# Altium project COMM_BOARD_V1.PrjPcb (part 2 of 2)
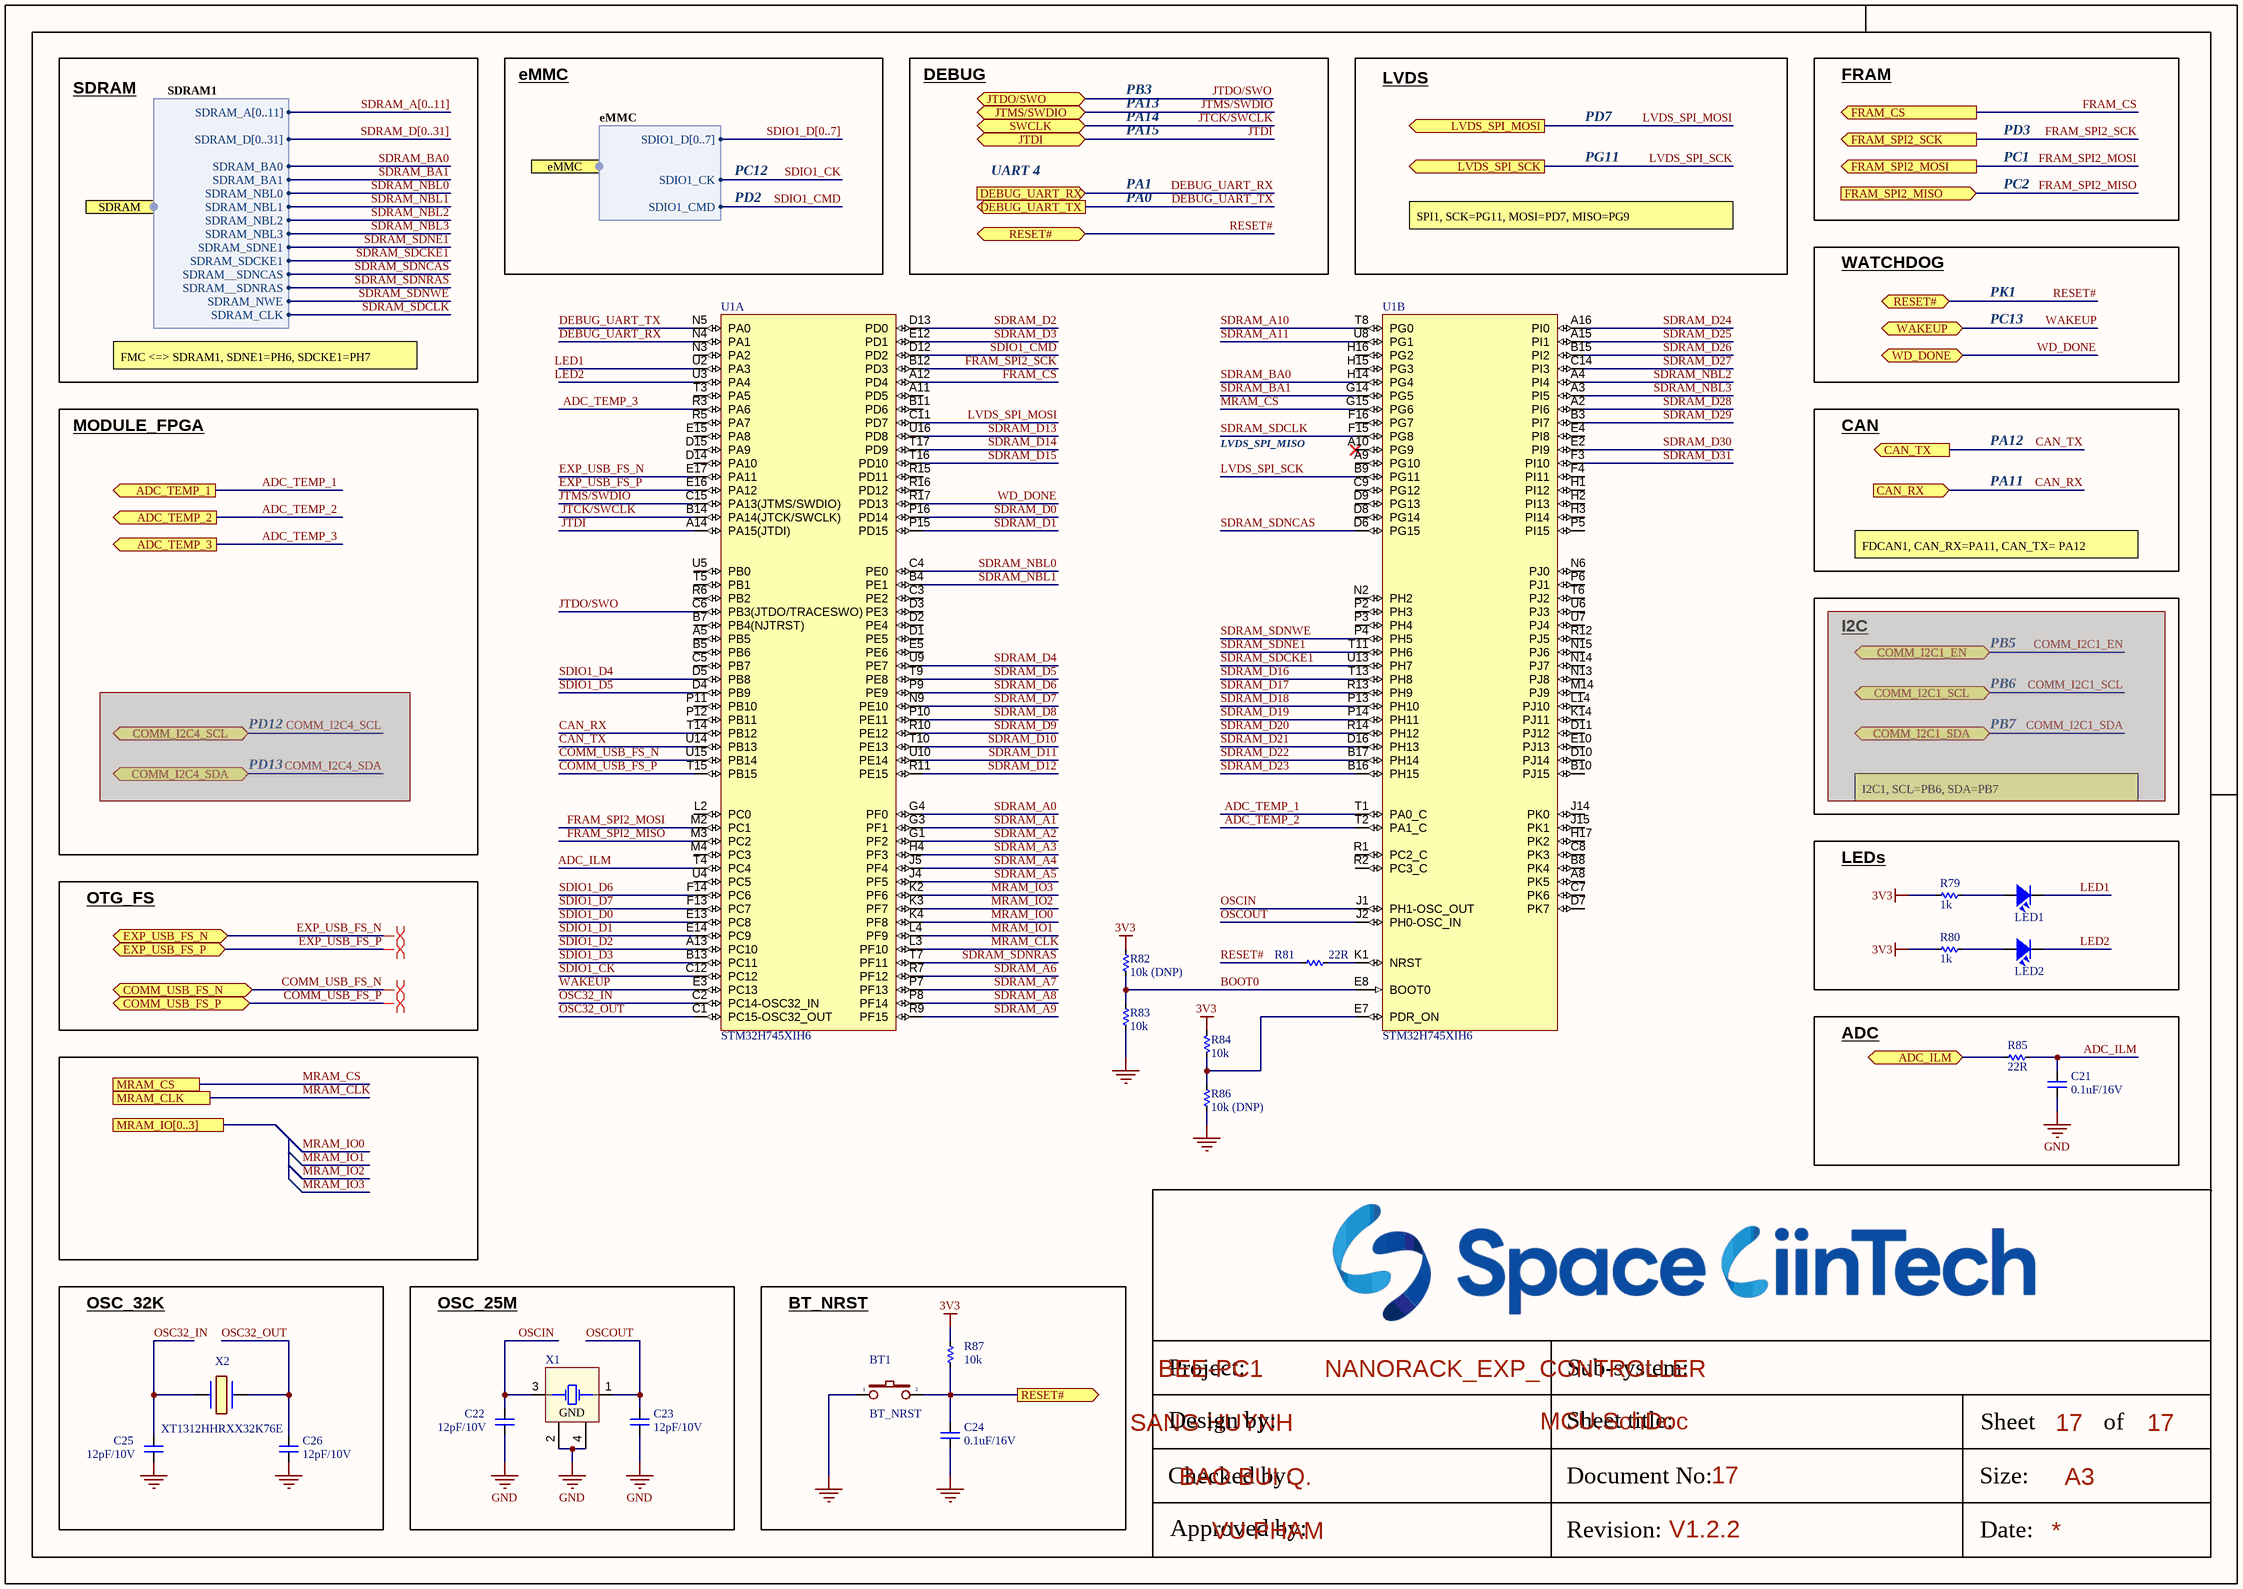
[diagram p17: MCU.SchDoc]

## Nets that join several sheets
3V3: POWER (8 pins), eMMC (38 pins), SDRAM (28 pins), MRAM (C31.2 C32.2 U4.8), LVDS (6 pins), CAN (C33.1 C34.1 U5.3), FRAM (5 pins), TEMP_CTRL (6 pins), WATCHDOG (C59.2 U15.1), DEBUG (J5.10 J5BK.1), MCU_POWER (57 pins), MCU (5 pins)
12V_CONN: CONNECTOR (J2.1 J2B.9), POWER (9 pins)
GND: CONNECTOR (20 pins), POWER (27 pins), USB_FS (8 pins), eMMC (27 pins), SDRAM (28 pins), MRAM (C31.1 C32.1 U4.4), LVDS (11 pins), CAN (6 pins), FRAM (C58.1 U14.4), TEMP_CTRL (9 pins), WATCHDOG (C59.1 R161.1 R162.1 U15.2), DEBUG (J5.6 J5BK.9), MCU_POWER (84 pins), MCU (11 pins)
ADC_TEMP_1: TEMP_CTRL (C98.2 R163.2), MCU (U1.T1)
ADC_TEMP_2: TEMP_CTRL (C100.2 R164.2), MCU (U1.T2)
ADC_TEMP_3: TEMP_CTRL (C103.2 R165.2), MCU (U1.R3)
CAN_RX: CAN (U5.4), MCU (U1.T14)
CAN_TX: CAN (U5.1), MCU (U1.U14)
COMM_USB_FS_N: USB_FS (J6.2), MCU (U1.U15)
COMM_USB_FS_P: USB_FS (J6.3), MCU (U1.T15)
DEBUG_UART_RX: DEBUG (J5.8 J5BK.5), MCU (U1.N4)
DEBUG_UART_TX: DEBUG (J5.7 J5BK.7), MCU (U1.N5)
EXP_USB_FS_N: CONNECTOR (J2.8 J2B.2), MCU (U1.E17)
EXP_USB_FS_P: CONNECTOR (J2.7 J2B.3), MCU (U1.E16)
FRAM_CS: FRAM (R154.1), MCU (U1.A12)
FRAM_SPI2_MISO: FRAM (R157.1), MCU (U1.M3)
FRAM_SPI2_MOSI: FRAM (R156.1), MCU (U1.M2)
FRAM_SPI2_SCK: FRAM (R155.1), MCU (U1.B12)
JTCK/SWCLK: DEBUG (J5.4 J5BK.4), MCU (U1.B14)
JTDI: DEBUG (J5.2 J5BK.8), MCU (U1.A14)
JTDO/SWO: DEBUG (J5.5 J5BK.2), MCU (U1.C6)
JTMS/SWDIO: DEBUG (J5.3 J5BK.6), MCU (U1.C15)
LVDS_SPI_MOSI: LVDS (U6.5), MCU (U1.C11)
LVDS_SPI_SCK: LVDS (U7.5), MCU (U1.B9)
MRAM_CLK: MRAM (R98.2), MCU (U1.L3)
MRAM_CS: MRAM (R94.1), MCU (U1.G15)
NetJ2_3: CONNECTOR (J2.3 J2B.7 R143.1), CAN (R114.2 TVS2.1 U5.7)
NetJ2_4: CONNECTOR (J2.4 J2B.6 R142.1), CAN (R115.1 TVS2.2 U5.6)
NetJ2_9: CONNECTOR (J2.9 J2B.1), POWER (R88.1)
NetR85_1: POWER (R126.1 U9.9), MCU (R85.1)
RESET#: eMMC (R19.2), WATCHDOG (R158.2), DEBUG (J5.9 J5BK.3), MCU (BT1.2 C24.2 R81.1 R87.2)
SDIO1_CK: eMMC (R18.1 R20.1), MCU (U1.C12)
SDIO1_CMD: eMMC (R21.1 R22.1), MCU (U1.D12)
SDIO1_D0: eMMC (R1.1 R9.1), MCU (U1.E13)
SDIO1_D1: eMMC (R2.1 R10.1), MCU (U1.E14)
SDIO1_D2: eMMC (R3.1 R11.1), MCU (U1.A13)
SDIO1_D3: eMMC (R4.1 R12.1), MCU (U1.B13)
SDIO1_D4: eMMC (R5.1 R13.1), MCU (U1.D5)
SDIO1_D5: eMMC (R6.1 R14.1), MCU (U1.D4)
SDIO1_D6: eMMC (R7.1 R15.1), MCU (U1.F14)
SDIO1_D7: eMMC (R8.1 R16.1), MCU (U1.F13)
SDRAM_A0: SDRAM (R45.1), MCU (U1.G4)
SDRAM_A1: SDRAM (R43.1), MCU (U1.G3)
SDRAM_A2: SDRAM (R41.1), MCU (U1.G1)
SDRAM_A3: SDRAM (R39.1), MCU (U1.H4)
SDRAM_A4: SDRAM (R37.1), MCU (U1.J5)
SDRAM_A5: SDRAM (R35.1), MCU (U1.J4)
SDRAM_A6: SDRAM (R33.1), MCU (U1.R7)
SDRAM_A7: SDRAM (R31.1), MCU (U1.P7)
SDRAM_A8: SDRAM (R29.1), MCU (U1.P8)
SDRAM_A9: SDRAM (R27.1), MCU (U1.R9)
SDRAM_A10: SDRAM (R25.1), MCU (U1.T8)
SDRAM_A11: SDRAM (R23.1), MCU (U1.U8)
SDRAM_BA0: SDRAM (R50.1), MCU (U1.H14)
SDRAM_BA1: SDRAM (R48.1), MCU (U1.G14)
SDRAM_D0: SDRAM (R78.2), MCU (U1.P16)
SDRAM_D1: SDRAM (R77.2), MCU (U1.P15)
SDRAM_D2: SDRAM (R76.2), MCU (U1.D13)
SDRAM_D3: SDRAM (R75.2), MCU (U1.E12)
SDRAM_D4: SDRAM (R74.2), MCU (U1.U9)
SDRAM_D5: SDRAM (R73.2), MCU (U1.T9)
SDRAM_D6: SDRAM (R72.2), MCU (U1.P9)
SDRAM_D7: SDRAM (R70.2), MCU (U1.N9)
SDRAM_D8: SDRAM (R68.2), MCU (U1.P10)
SDRAM_D9: SDRAM (R66.2), MCU (U1.R10)
SDRAM_D10: SDRAM (R64.2), MCU (U1.T10)
SDRAM_D11: SDRAM (R63.2), MCU (U1.U10)
SDRAM_D12: SDRAM (R61.2), MCU (U1.R11)
SDRAM_D13: SDRAM (R59.2), MCU (U1.U16)
SDRAM_D14: SDRAM (R57.2), MCU (U1.T17)
SDRAM_D15: SDRAM (R55.2), MCU (U1.T16)
SDRAM_D16: SDRAM (R52.2), MCU (U1.T13)
SDRAM_D17: SDRAM (R51.2), MCU (U1.R13)
SDRAM_D18: SDRAM (R49.2), MCU (U1.P13)
SDRAM_D19: SDRAM (R47.2), MCU (U1.P14)
SDRAM_D20: SDRAM (R46.2), MCU (U1.R14)
SDRAM_D21: SDRAM (R44.2), MCU (U1.D16)
SDRAM_D22: SDRAM (R42.2), MCU (U1.B17)
SDRAM_D23: SDRAM (R40.2), MCU (U1.B16)
SDRAM_D24: SDRAM (R38.2), MCU (U1.A16)
SDRAM_D25: SDRAM (R36.2), MCU (U1.A15)
SDRAM_D26: SDRAM (R34.2), MCU (U1.B15)
SDRAM_D27: SDRAM (R32.2), MCU (U1.C14)
SDRAM_D28: SDRAM (R30.2), MCU (U1.A2)
SDRAM_D29: SDRAM (R28.2), MCU (U1.B3)
SDRAM_D30: SDRAM (R26.2), MCU (U1.E2)
SDRAM_D31: SDRAM (R24.2), MCU (U1.F3)
SDRAM_NBL0: SDRAM (R71.1), MCU (U1.C4)
SDRAM_NBL1: SDRAM (R69.1), MCU (U1.B4)
SDRAM_NBL2: SDRAM (R67.1), MCU (U1.A4)
SDRAM_NBL3: SDRAM (R65.1), MCU (U1.A3)
SDRAM_SDCKE1: SDRAM (R60.1), MCU (U1.U13)
SDRAM_SDCLK: SDRAM (R62.1), MCU (U1.F15)
SDRAM_SDNCAS: SDRAM (R54.1), MCU (U1.D6)
SDRAM_SDNE1: SDRAM (R58.1), MCU (U1.T11)
SDRAM_SDNRAS: SDRAM (R56.1), MCU (U1.T7)
SDRAM_SDNWE: SDRAM (R53.1), MCU (U1.P4)
WAKEUP: WATCHDOG (R159.2), MCU (U1.E3)
WD_DONE: WATCHDOG (R160.2), MCU (U1.R17)